# EAGLE design inclinometro (EAGLE 9.6.2)
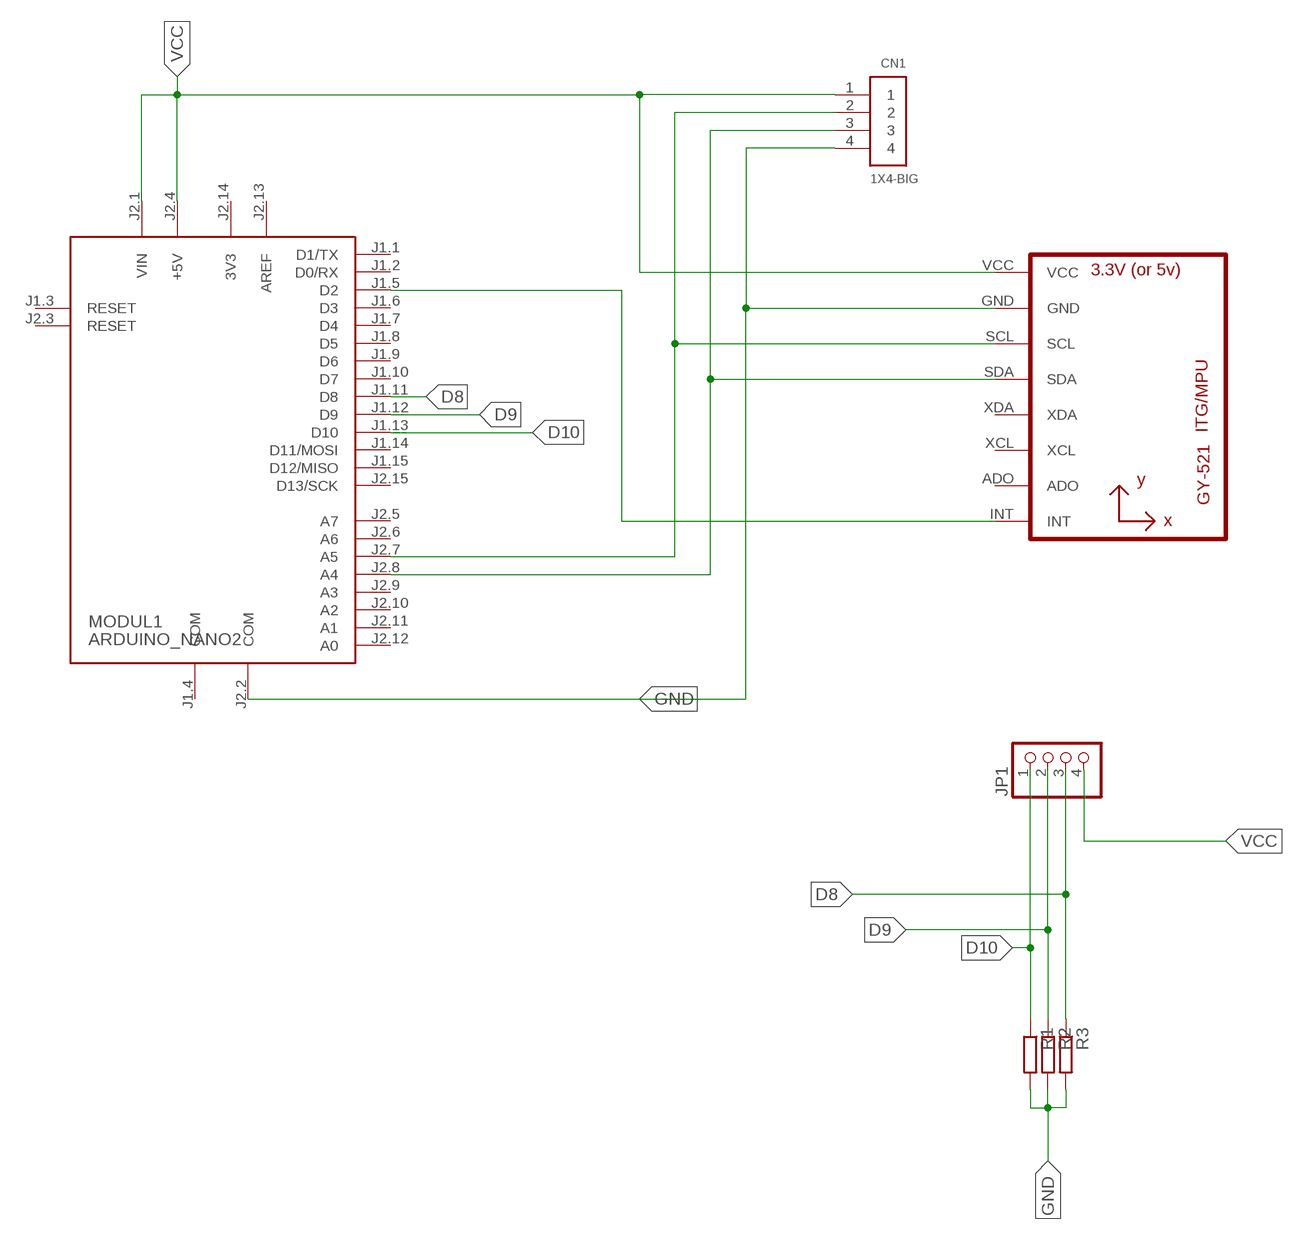
[diagram p0: schematic, sheet 1]

## Parts
CN1  1X4-BIG  [1X04-BIG]
JP1  PINHD-1X4  [1X04]
MODUL1  ARDUINO_NANO2  [ARDUINO_NANO2]
R1  R-EU_0207/10  [0207/10]
R2  R-EU_0207/10  [0207/10]
R3  R-EU_0207/10  [0207/10]
U1  GY-521MPU6050  [GY-521]

## Nets
D8: JP1.3 MODUL1.J1.11(D8) R3.1
D9: JP1.2 MODUL1.J1.12(D9) R2.1
D10: JP1.1 MODUL1.J1.13(D10) R1.1
GND: CN1.4 MODUL1.J2.2(COM) R1.2 R2.2 R3.2 U1.GND
N$1: CN1.3 MODUL1.J2.8(A4) U1.SDA
N$2: CN1.2 MODUL1.J2.7(A5) U1.SCL
N$5: MODUL1.J1.5(D2) U1.INT
VCC: CN1.1 JP1.4 MODUL1.J2.1(VIN) MODUL1.J2.4(+5V) U1.VCC
Unconnected: MODUL1.J1.1(D1/TX) MODUL1.J1.2(D0/RX) MODUL1.J1.3(RESET) MODUL1.J1.6(D3) MODUL1.J1.7(D4) MODUL1.J1.8(D5) MODUL1.J1.9(D6) MODUL1.J1.10(D7) MODUL1.J1.14(D11/MOSI) MODUL1.J1.15(D12/MISO) MODUL1.J2.3(RESET) MODUL1.J2.5(A7) MODUL1.J2.6(A6) MODUL1.J2.9(A3) MODUL1.J2.10(A2) MODUL1.J2.11(A1) MODUL1.J2.12(A0) MODUL1.J2.15(D13/SCK) U1.ADO U1.XCL U1.XDA

## Power pins joined to a net without a drawn wire
3V3: MODUL1.J2.14(3V3)
AREF: MODUL1.J2.13(AREF)
COM: MODUL1.J1.4(COM)

## Library data of the parts
CN1 = adafruit:1X4: 4-pin connector
JP1 = pinhead:PINHD-1X4: PIN HEADER
MODUL1 = arduino:ARDUINO_NANO2: Arduino Nano2 Auto generated by modulcreator.ulp \;; ANZAHL: 2; MODUL: TRUE; STECKX0: -76200; STECKX1: 76200; STECKY0: 177800; STECKY1: 177800
R1-R3 = rcl:R-EU_: RESISTOR, European symbol; SPICEPREFIX: R
U1 = gy-521:GY-521

## Board
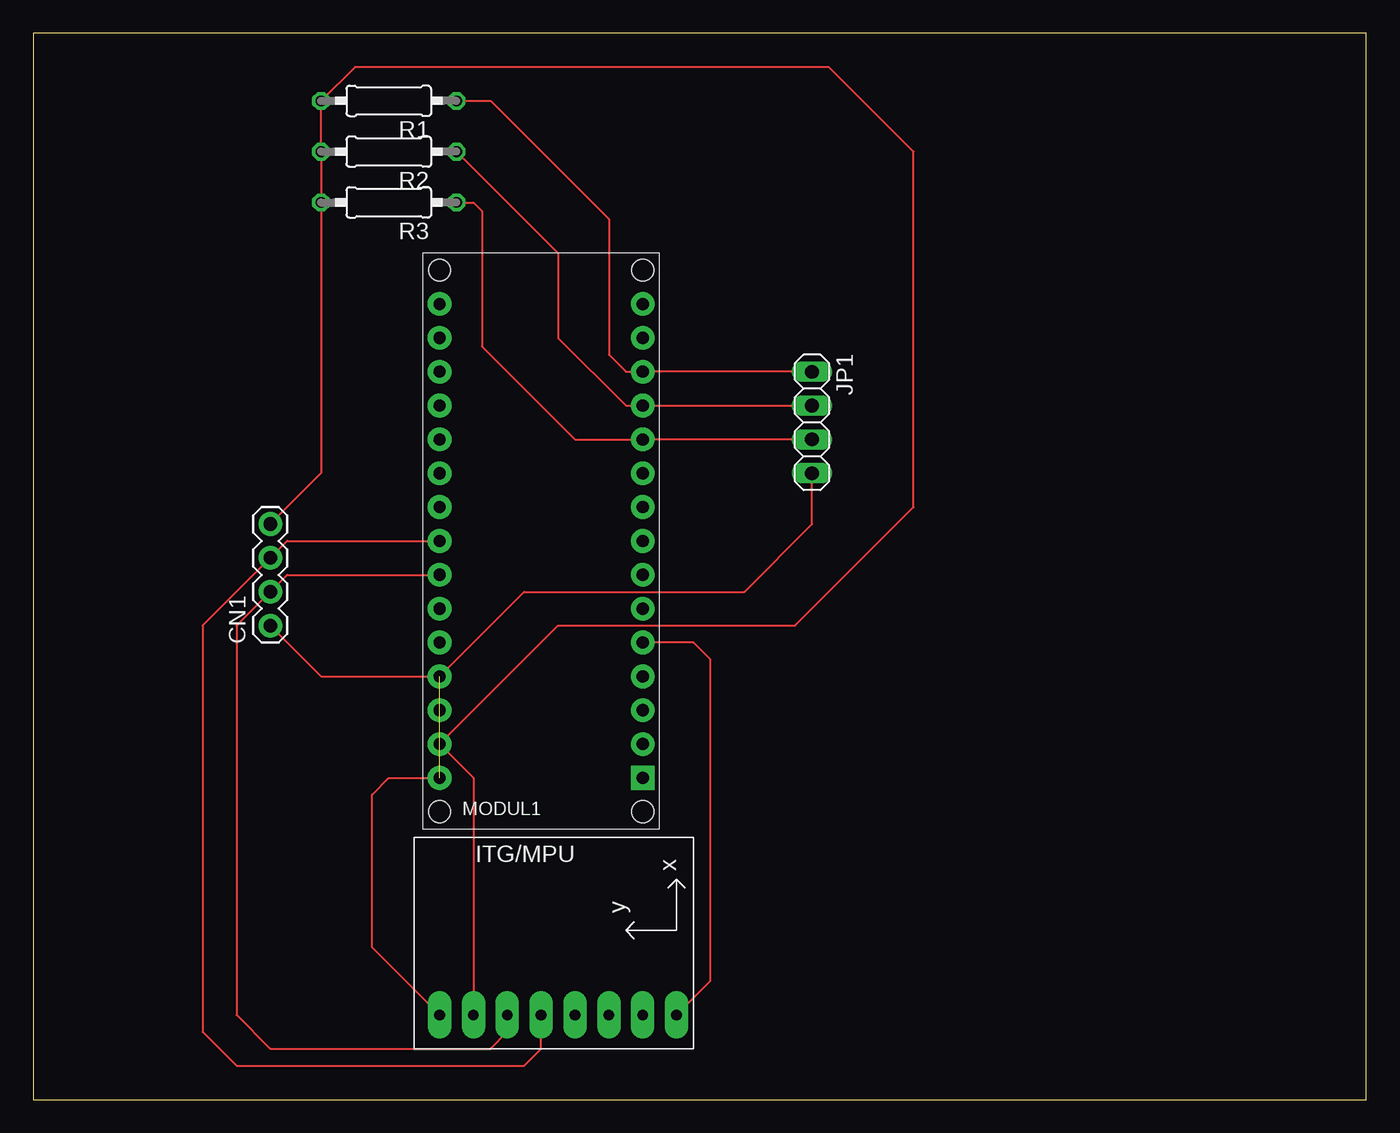
[diagram p1: board, top side]

Size 100 x 80 mm. Coordinates in mm from the lower left corner, seen from the top.
Outline: 0,0 100,0 100,80 0,80 0,0
Copper layers (1*16): Top 0.035mm / dielectric 1.5mm / Bottom 0.035mm
Design rules "default": minimum track width 6mil, minimum drill 0.35mm, track to track 6mil, track to pad 6mil, pad to pad 6mil, via to via 6mil, smd to smd 6mil, copper to edge 40mil, drill to drill 6mil, minimum pad ring 10mil, minimum via ring 8mil, stop-mask expansion 4mil, vias tented up to drill 0mil, thermal gap 10mil

### Footprints (pad centres in the part's own frame; a part is rotated, then mirrored left to right if it is on the bottom)
1X04-BIG = drill 1.016 pad 1.778: 1 0,0; 2 2.54,0; 3 5.08,0; 4 7.62,0
1X04 = drill 1.016 long: 1 -3.81,0; 2 -1.27,0; 3 1.27,0; 4 3.81,0
ARDUINO_NANO2 = drill 0.914 pad 1.778 square: J1.1 -7.62,17.78 | drill 0.914 pad 1.778: J1.2 -7.62,15.24; J1.3 -7.62,12.7; J1.4 -7.62,10.16; J1.5 -7.62,7.62; J1.6 -7.62,5.08; J1.7 -7.62,2.54; J1.8 -7.62,0; J1.9 -7.62,-2.54; J1.10 -7.62,-5.08; J1.11 -7.62,-7.62; J1.12 -7.62,-10.16; J1.13 -7.62,-12.7; J1.14 -7.62,-15.24; J1.15 -7.62,-17.78; J2.1 7.62,17.78; J2.2 7.62,15.24; J2.3 7.62,12.7; J2.4 7.62,10.16; J2.5 7.62,7.62; J2.6 7.62,5.08; J2.7 7.62,2.54; J2.8 7.62,0; J2.9 7.62,-2.54; J2.10 7.62,-5.08; J2.11 7.62,-7.62; J2.12 7.62,-10.16; J2.13 7.62,-12.7; J2.14 7.62,-15.24; J2.15 7.62,-17.78 | hole 1.651: -7.62,-20.32; 7.62,-20.32; 7.62,20.32; -7.62,20.32
0207/10 = drill 0.813 octagon: 1 -5.08,0; 2 5.08,0
GY-521 = drill 0.8 pad 1.778 long: ADO -8.89,-6.35; GND -8.89,6.35; INT -8.89,-8.89; SCL -8.89,3.81; SDA -8.89,1.27; VCC -8.89,8.89; XCL -8.89,-3.81; XDA -8.89,-1.27

### Placement (x,y rotation side)
CN1  17.78,35.56 90 top
JP1  58.42,50.8 270 top
MODUL1  38.1,41.91 180 top
R1  26.67,74.93 180 top
R2  26.67,71.12 180 top
R3  26.67,67.31 180 top
U1  39.37,15.24 90 top

### Tracks (layer width: path | path; a pad name or v marks a point on that pad's centre or on a via)
D8
  Top 0.152: JP1.3 MODUL1.J1.11 40.64,49.53 33.67,56.5 33.67,66.66 33.02,67.31 R3.1
D9
  Top 0.152: JP1.2 MODUL1.J1.12 44.45,52.07 39.37,57.15 39.37,63.5 R2.1
D10
  Top 0.152: JP1.1 MODUL1.J1.13 44.45,54.61 43.18,55.88 43.18,66.04 34.29,74.93 R1.1
GND
  Top 0.152: U1.GND 33.02,24.13 MODUL1.J2.2 39.37,35.56 57.15,35.56 66.04,44.45 66.04,71.12 59.69,77.47 24.13,77.47 R1.2 R2.2 R3.2 21.59,46.99 CN1.4
N$1
  Top 0.152: MODUL1.J2.8 19.05,41.91 CN1.3 12.7,35.56 12.7,5.08 15.24,2.54 36.83,2.54 38.1,3.81 U1.SDA
N$2
  Top 0.152: MODUL1.J2.7 19.05,39.37 CN1.2 15.24,35.56 15.24,6.35 17.78,3.81 34.29,3.81 35.56,5.08 U1.SCL
N$5
  Top 0.152: U1.INT 50.8,8.89 50.8,33.02 49.53,34.29 MODUL1.J1.5
VCC  (1 unrouted)
  Top 0.152: CN1.1 21.59,31.75 MODUL1.J2.4 36.83,38.1 53.34,38.1 58.42,43.18 JP1.4 | U1.VCC 25.4,11.43 25.4,13.97 25.4,22.86 26.67,24.13 MODUL1.J2.1